# Altium schematic sheet RPL_IGNITION.SchDoc: Ignition
size A; Date: Dec 27, 2017; DrawnBy: Seyed Omid Hasanli; Revision: 1.0; SheetNumber: 13
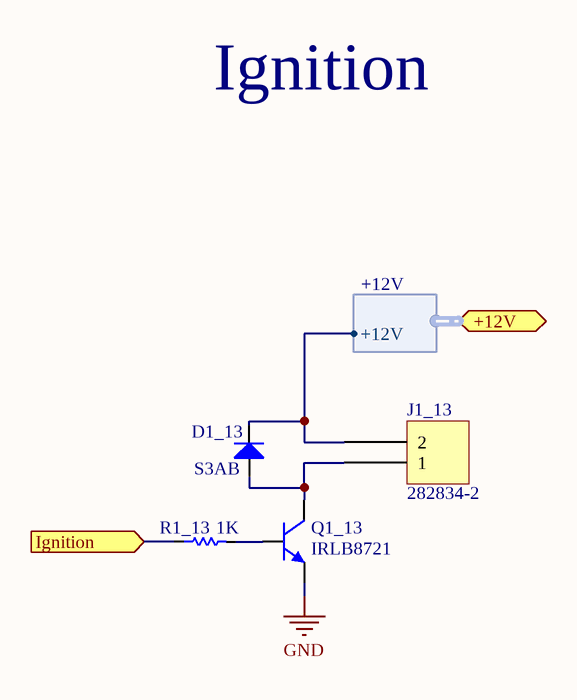
[diagram p0: RPL_IGNITION.SchDoc]

## Parts
D1_13  S3AB  [S3AB]
J1_13  282834-2  [TE 282834-2]
Q1_13  IRLB8721  [TO220]
R1_13  value 1K  [RES 0805]  (hidden comment: Res)

## Ports
+12V (harness +12V), Ignition (in)

## Harnesses
+12V: +12V

## Nets
GND: Q1_13.1(E)
Ignition: R1_13.1 ; port Ignition
NetD1_13_A: D1_13.A J1_13.1 Q1_13.3(C)
NetD1_13_K: D1_13.K J1_13.2 ; port +12V.+12V
NetQ1_13_2: Q1_13.2(B) R1_13.2

## Notes on the sheet
- Ignition
- Title:
- DrawnBy:
- Revision:
- SheetNumber:
- Date:
- Datasheet Link:

## Library data of the parts
D1_13 = Diod Rectifire: Link: https://www.mouser.com/productdetail/on-semiconductor-fairchild/s3ab?qs=sGAEpiMZZMtbRapU8LlZD8eZ1FFRrq3pn%2FcN8IJzN01nfWZFKw516g%3D%3D
J1_13 = 282834-2: TERM BLOCK 2POS SIDE ENT 2.54MM; Manufacturer: TE Connectivity AMP Connectors; TemperatureRange: -40C ~ 105C; Voltage: 150V; Pitch: 0.100" (2.54mm); Number Of Levels: 1; Positions Per Level: 2; Part Number: 282834-2; PartId: 9289; Supplier 1: Digi-Key; Supplier Part Number 1: A98333-ND; ComponentLink1Description: Datasheet; ComponentLink1URL: http://www.te.com/commerce/DocumentDelivery/DDEController?Action=srchrtrv&DocNm=282834&DocType=Customer+Drawing&DocLang=English; ComponentLink2Description: Digi-Key Listing; ComponentLink2URL: http://www.digikey.ca/product-detail/en/282834-2/A98333-ND/1150135; Price: 1.3; Colour: Green; Orientation: Horizontal with Board
Q1_13 = IRLB8721: NPN General Purpose Amplifier; Link: https://www.digikey.com/products/en?keywords=%20IRLB8721%20